# EAGLE design rf_ib8 (EAGLE 5.11)
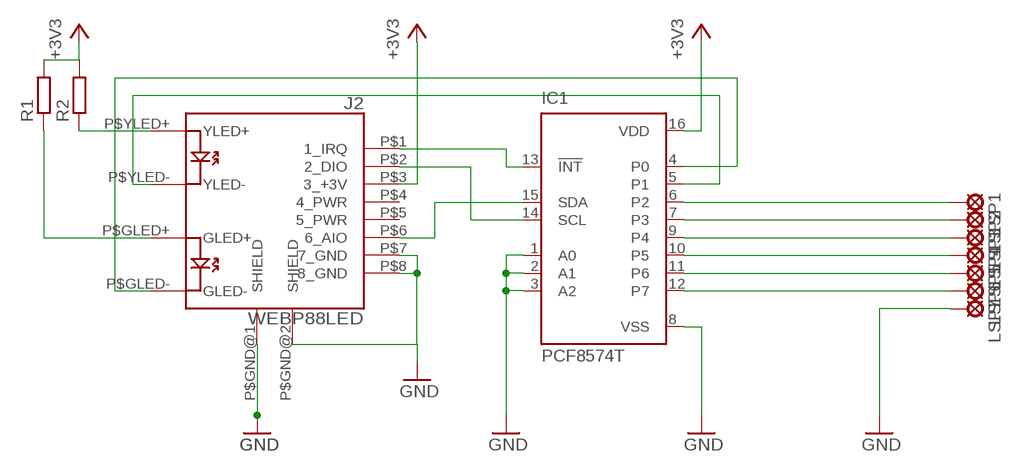
[diagram p0: schematic, sheet 1]

## Parts
IC1  PCF8574T  [SO16W]
J2  WEBP88LED  [WEBP88LED]
LSP1  LSP10  [LSP10]
LSP2  LSP10  [LSP10]
LSP3  LSP10  [LSP10]
LSP4  LSP10  [LSP10]
LSP5  LSP10  [LSP10]
LSP6  LSP10  [LSP10]
LSP7  LSP10  [LSP10]
R1  R-EU_0204/7  [0204/7]
R2  R-EU_0204/7  [0204/7]

## Nets
+3V3: IC1.16(VDD) J2.P$3(3_+3V) R1.2 R2.2
GND: IC1.1(A0) IC1.2(A1) IC1.3(A2) IC1.8(VSS) J2.P$GND@1(SHIELD) LSP7.MP
N$1: IC1.12(P7) LSP6.MP
N$2: IC1.11(P6) LSP5.MP
N$3: IC1.10(P5) LSP4.MP
N$4: IC1.9(P4) LSP3.MP
N$5: IC1.7(P3) LSP2.MP
N$6: IC1.6(P2) LSP1.MP
N$10: IC1.5(P1) J2.P$YLED-(YLED-)
N$12: J2.P$YLED+(YLED+) R2.1
N$13: J2.P$7(7_GND) J2.P$8(8_GND) J2.P$GND@2(SHIELD) ; supply symbol labelled GND
N$14: IC1.15(SDA) J2.P$6(6_AIO)
N$17: J2.P$GLED+(GLED+) R1.1
N$21: IC1.14(SCL) J2.P$2(2_DIO)
N$22: IC1.13(!INT) J2.P$1(1_IRQ)
N$33: IC1.4(P0) J2.P$GLED-(GLED-)
Unconnected: J2.P$4(4_PWR) J2.P$5(5_PWR)

## Library data of the parts
IC1 = micro-philips:PCF8574: I2C-Bus Remote 8-bit I/O expander http://www.semiconductors.philips.com/acrobat_download/datasheets/PCF8574_4.pdf; MPN: PCF8574T/3,512; OC_FARNELL: 1201255; OC_NEWARK: 70R6870
J2 = Prcek:WEBP88LED
LSP1-LSP7 = solpad:LSP10: SOLDER PAD drill 1.0 mm, distributor Buerklin, 12H555
R1 R2 = resistor:R-EU_: RESISTOR, European symbol

## Board
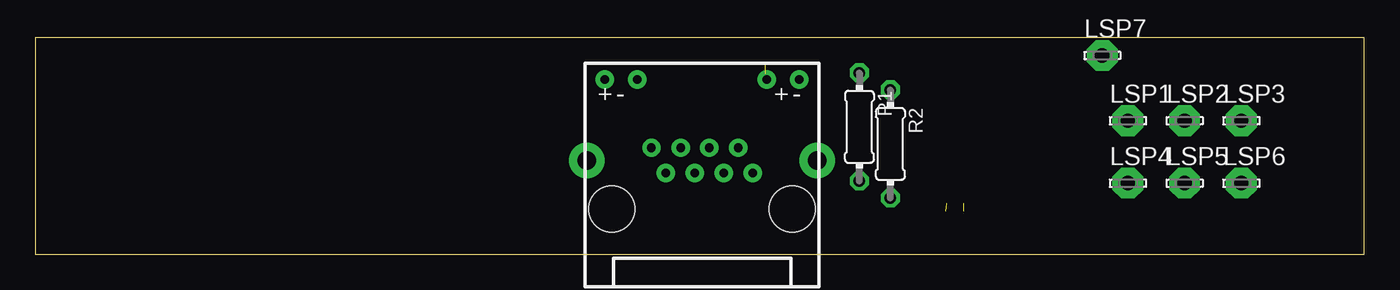
[diagram p1: board, top side]
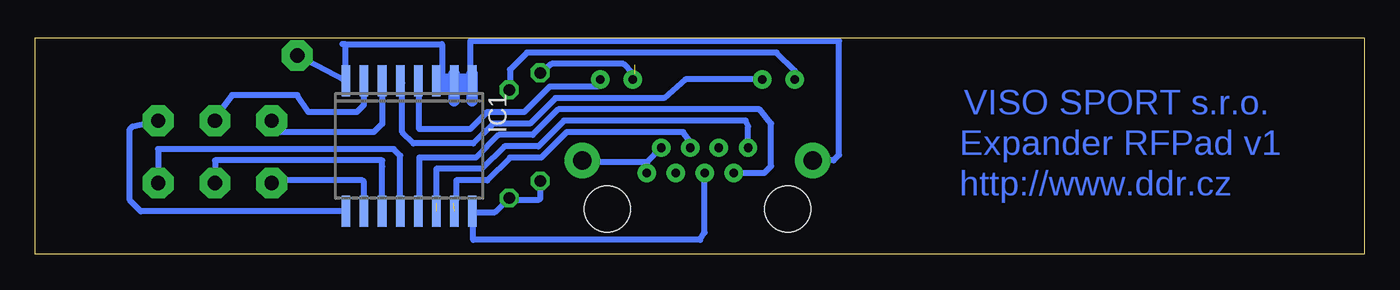
[diagram p2: board, bottom side, seen from below]

Size 93.65 x 15.23 mm. Coordinates in mm from the lower left corner, seen from the top.
Outline: 0,0 93.65,0 93.65,15.23 0,15.23 0,0
Copper layers (1*16): Top 0.035mm / dielectric 1.5mm / Bottom 0.035mm
Design rules "default": minimum track width 10mil, minimum drill 24mil, track to track 8mil, track to pad 8mil, pad to pad 8mil, via to via 8mil, smd to smd 8mil, copper to edge 40mil, drill to drill 8mil, minimum pad ring 10mil, minimum via ring 8mil, stop-mask expansion 4mil, vias tented up to drill 0mil, thermal gap 10mil

### Footprints (pad centres in the part's own frame; a part is rotated, then mirrored left to right if it is on the bottom)
SO16W = smd 0.6 x 2.2: 1 -4.445,-4.6; 2 -3.175,-4.6; 3 -1.905,-4.6; 4 -0.635,-4.6; 5 0.635,-4.6; 6 1.905,-4.6; 7 3.175,-4.6; 8 4.445,-4.6; 9 4.445,4.6; 10 3.175,4.6; 11 1.905,4.6; 12 0.635,4.6; 13 -0.635,4.6; 14 -1.905,4.6; 15 -3.175,4.6; 16 -4.445,4.6
WEBP88LED = drill 0.6 pad 1.3 round: P$1 -2.554,2.54; P$2 -3.566,4.32; P$3 -0.514,2.54; P$4 -1.516,4.32; P$5 1.516,2.54; P$6 0.514,4.32; P$7 3.566,2.54; P$8 2.554,4.32; P$GLED+ 4.57,9.14; P$GLED- 6.86,9.14; P$YLED+ -6.86,9.14; P$YLED- -4.57,9.14 | drill 1.3 pad 2.5 round: P$GND@1 -8.125,3.43; P$GND@2 8.125,3.43 | hole 3.25: -6.35,0; 6.35,0
LSP10 = drill 1.016 pad 2.159 octagon: MP 0,0
0204/7 = drill 0.813 octagon: 1 -3.81,0; 2 3.81,0

### Placement (x,y rotation side)
IC1  67.31,7.62 180 bottom
J2  46.99,3.17 0 top
LSP1  77,9.4 0 top
LSP2  81,9.4 0 top
LSP3  85,9.4 0 top
LSP4  77,5 0 top
LSP5  81,5 0 top
LSP6  85,5 0 top
LSP7  75.2,14 0 top
R1  58.08,8.97 270 top
R2  60.26,7.77 270 top

### Tracks (layer width: path | path; a pad name or v marks a point on that pad's centre or on a via)
+3V3
  Bottom 0.406: J2.P$3 46.48,1.52 46.8,1 62.8,1 62.8,2.96 | 62.8,2.96 IC1.16 | 62.8,2.96 61.26,2.96 R2.2 60.1,3.8 58.2,3.8 58.08,3.92 R1.2
GND
  Bottom 0.406: 71.78,12.2 LSP7.MP | IC1.8 71.78,12.2 | J2.P$GND@1 37.4,6.61 37,7 37,15 63,15 63,12.36 IC1.1 IC1.2 IC1.3 65,12.62 65,14.8 72,14.8 71.78,14.78 71.78,12.2
N$1
  Bottom 0.406: IC1.12 67.94,6.95 68.4,7.4 85,7.4 LSP6.MP
N$2
  Bottom 0.406: IC1.11 69.22,6.18 69.2,6.6 81,6.6 LSP5.MP
N$3
  Bottom 0.406: IC1.10 70.48,5.08 70.6,5.2 76.8,5.2 LSP4.MP
N$4
  Bottom 0.406: IC1.9 86.22,3.02 87,3.8 87,8.8 86.8,9 LSP3.MP
N$5
  Bottom 0.406: IC1.7 70.48,10.52 71,10 74.4,10 75.2,11.2 79.8,11.2 81,9.6 LSP2.MP
N$6
  Bottom 0.406: IC1.6 69.22,9.19 69.8,8.6 76.6,8.6 LSP1.MP
N$10
  Bottom 0.406: J2.P$YLED- 47.84,12.31 49.35,11 57,11 58.8,9.2 61.4,9.2 62.8,7.8 67,7.8 67.8,8.6 67.8,12.07 IC1.5
N$11  (1 unrouted)
N$12
  Bottom 0.406: J2.P$YLED+ 40.13,12.93 41.4,14.2 59,14.2 60.2,13 60.2,11.64 R2.1
N$13
  Bottom 0.406: 50.56,6.48 J2.P$7 | J2.P$8 50.56,6.48 | 50.56,6.48 54.99,6.48 J2.P$GND@2
N$14  (1 unrouted)
  Bottom 0.406: J2.P$6 47.5,7.9 48,8.6 56.2,8.6 58,6.8 60.2,6.8 61.8,5.2 64,5.2 64,3.8 64.2,3.6
N$15  (via drill 0.5 pad 2)
  other vias: 40.58,3.17
N$16  (via drill 0.5 pad 2)
  other vias: 53.26,3.17
N$17
  Bottom 0.406: J2.P$GLED+ 51.56,12.76 52.2,13.4 57.26,13.4 R1.1
N$21  (1 unrouted)
  Bottom 0.406: J2.P$2 43.42,8.98 43.4,9 43.6,9.4 56.4,9.4 58.2,7.6 60.6,7.6 62.2,6 65.4,6 65.4,3.6
N$22
  Bottom 0.406: J2.P$1 42.28,5.71 41.8,6.2 41.8,9.2 42.6,10.2 56.8,10.2 58.6,8.4 61,8.4 62.6,6.8 66.6,6.8 66.6,3.1 IC1.13
N$23
  Bottom 0.61: 62.87,10.79 62.87,11.43
  Bottom 0.813: 62.87,10.79 62.87,12.7
N$24
  Bottom 0.61: 64.14,10.79 64.14,11.43
  Bottom 0.813: 64.14,10.79 64.14,12.7
N$33
  Bottom 0.406: J2.P$GLED- 53.85,12.15 54,11.8 57.4,11.8 59.2,10 61.8,10 63,8.8 66.6,8.8 66.6,12.14 IC1.4
(copper drawn outside any net)
  shapes: Bottom area x1

### Text on the board
Bottom: VISO SPORT s.r.o. | Expander RFPad v1 | http://www.ddr.cz